# Altium schematic sheet MCU.SchDoc
size A3; DrawnBy: JimBobJones; DocumentNumber: 3; SheetNumber: 3; SheetTotal: 4
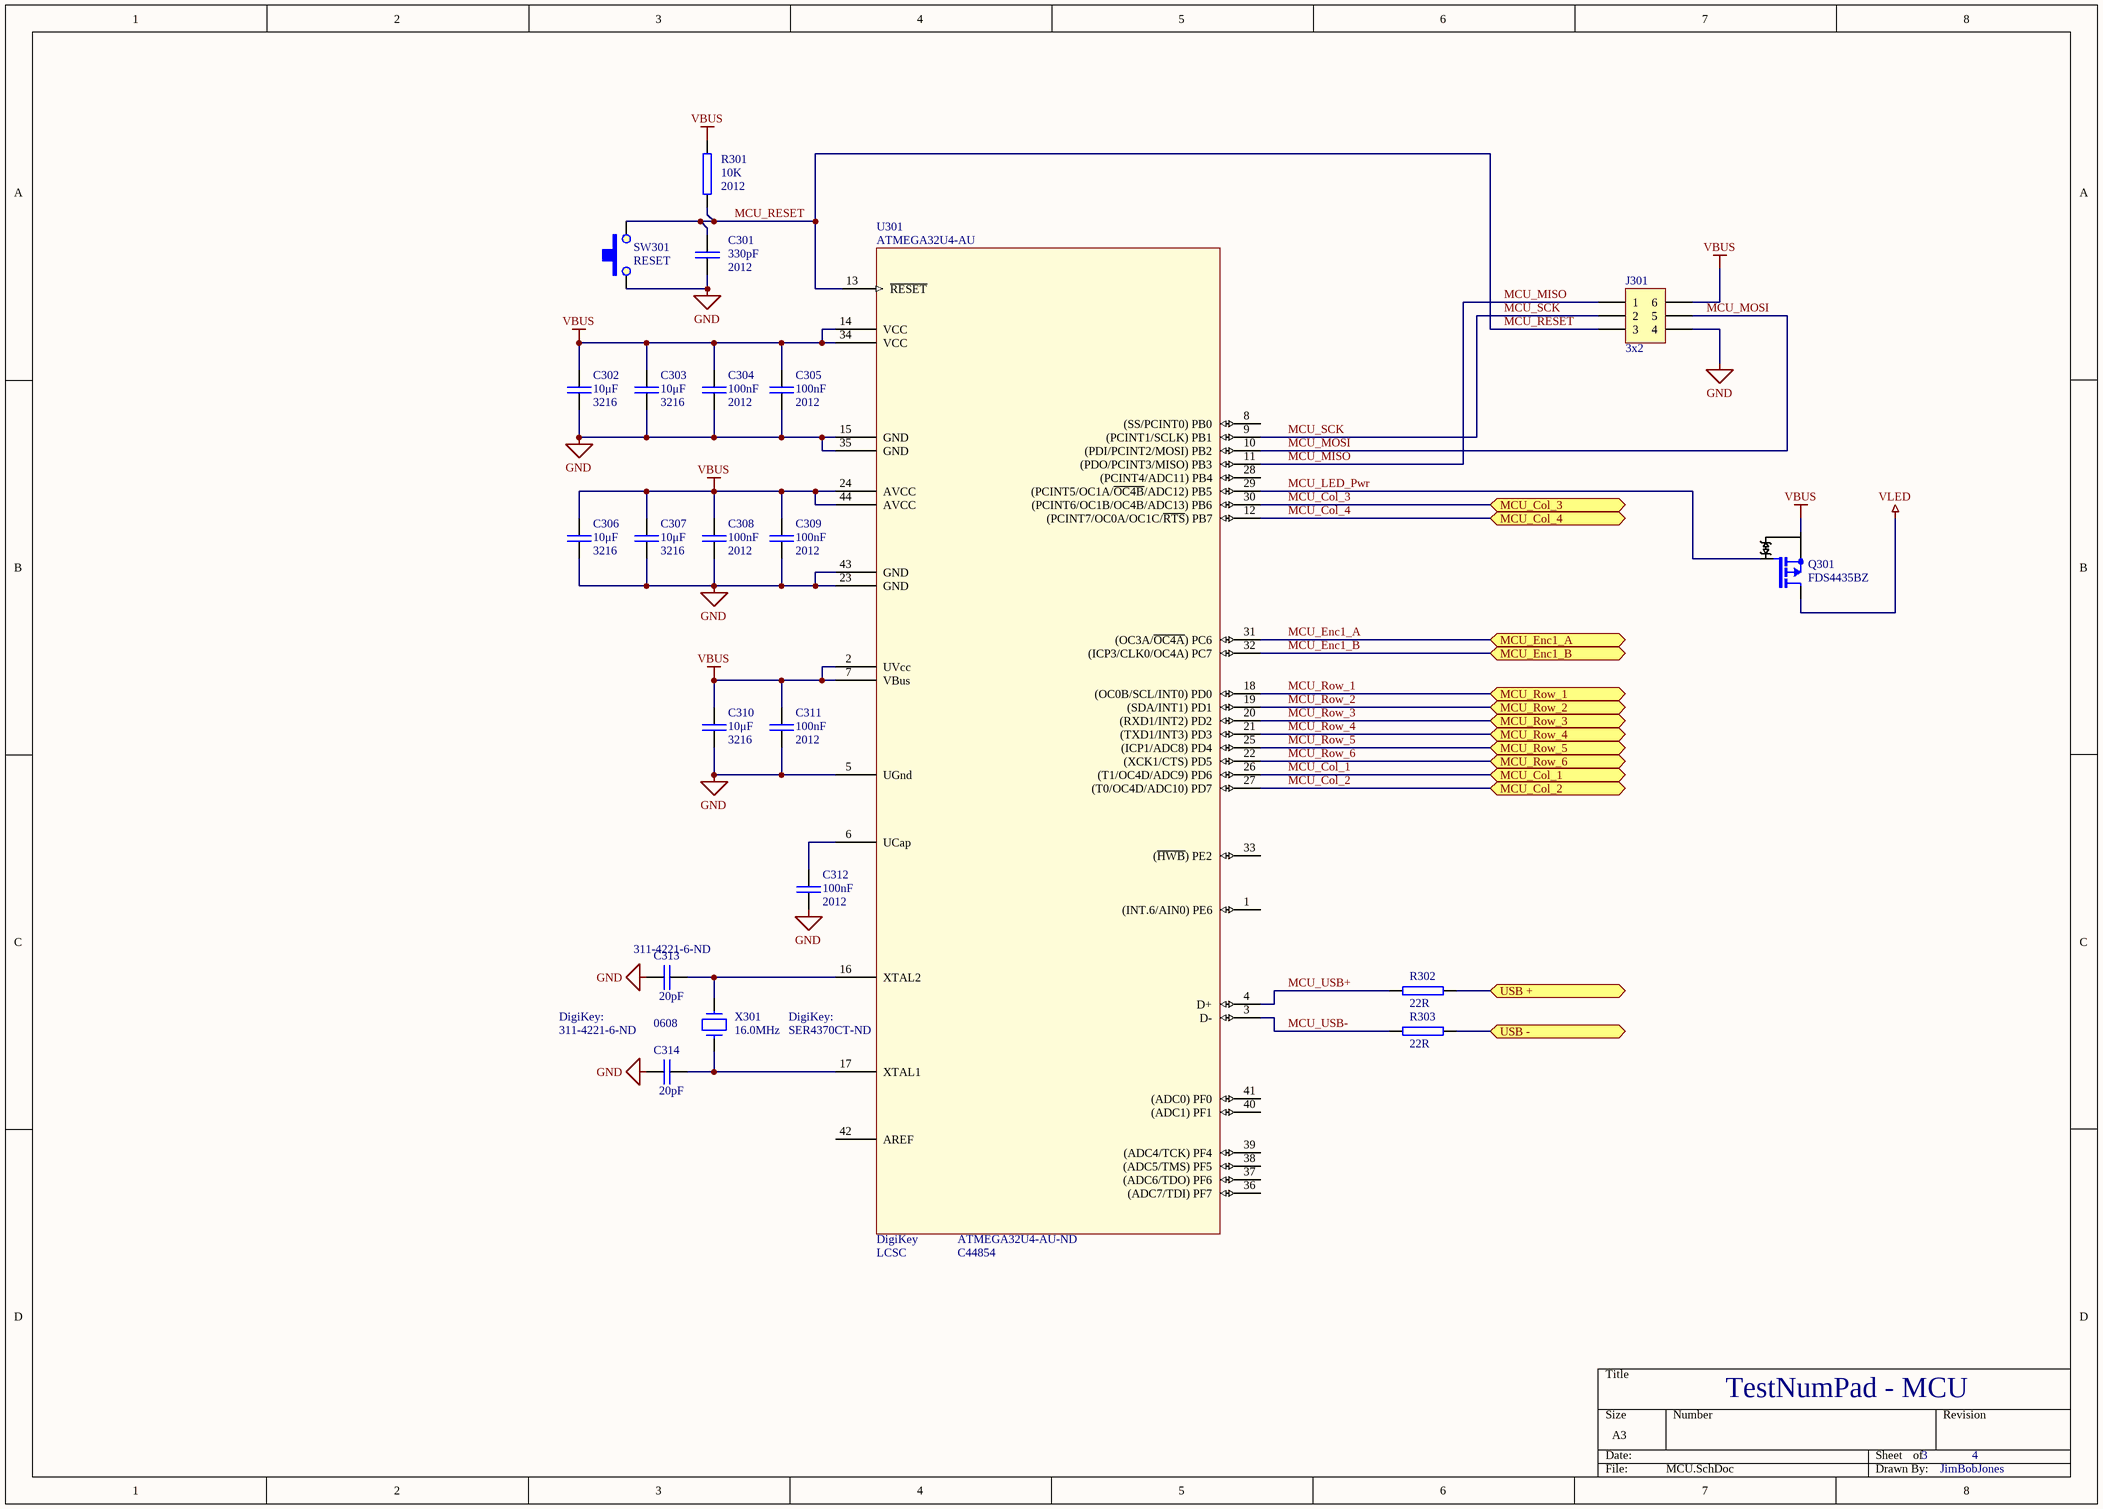
[diagram p0: MCU.SchDoc]

## Parts
C301  330pF  [2012C (0805)]
C302  10μF  [3216C (1206)]
C303  10μF  [3216C (1206)]
C304  100nF  [2012C (0805)]
C305  100nF  [2012C (0805)]
C306  10μF  [3216C (1206)]
C307  10μF  [3216C (1206)]
C308  100nF  [2012C (0805)]
C309  100nF  [2012C (0805)]
C310  10μF  [3216C (1206)]
C311  100nF  [2012C (0805)]
C312  100nF  [2012C (0805)]
C313  20pF  Supplier Part Number 1: 311-4221-6-ND  [1608C (0603)]
C314  20pF  Supplier Part Number 1: 311-4221-6-ND  [1608C (0603)]
J301  3x2  [Header-3x2-NoMod]
Q301  FDS4435BZ  [SO8-150/200mil-GDS]
R301  10K  [2012R-10K]
R302  22R  [2012R-22]
R303  22R  [2012R-22]
SW301  RESET  [SW_PB6x6]
U301  ATMEGA32U4-AU  Supplier Part Number 1: C44854  Supplier Part Number 2: ATMEGA32U4-AU-ND  [TQFP-44-0.8]
X301  16.0MHz  Supplier Part Number 1: SER4370CT-ND  [Crystal_4-SMD]

## Ports
MCU_Col_1 (bidir), MCU_Col_2 (bidir), MCU_Col_3 (bidir), MCU_Col_4 (bidir), MCU_Enc1_A (bidir), MCU_Enc1_B (bidir), MCU_Row_1 (bidir), MCU_Row_2 (bidir), MCU_Row_3 (bidir), MCU_Row_4 (bidir), MCU_Row_5 (bidir), MCU_Row_6 (bidir), USB + (bidir), USB - (bidir)

## Nets
GND: C301.2 C302.2 C303.2 C304.2 C305.2 C306.2 C307.2 C308.2 C309.2 C310.2 C311.2 C312.2 C313.1 C314.1 J301.4 SW301.1(COM) U301.5(UGnd) U301.15(GND) U301.23(GND) U301.35(GND) U301.43(GND)
VBUS: C302.1 C303.1 C304.1 C305.1 C306.1 C307.1 C308.1 C309.1 C310.1 C311.1 J301.6 Q301.S R301.1 U301.2(UVcc) U301.7(VBus) U301.14(VCC) U301.24(AVCC) U301.34(VCC) U301.44(AVCC)
VLED: Q301.D
MCU_Col_1: U301.26((T1/OC4D/ADC9)_PD6) ; port MCU_Col_1
MCU_Col_2: U301.27((T0/OC4D/ADC10)_PD7) ; port MCU_Col_2
MCU_Col_3: U301.30((PCINT6/OC1B/OC4B/ADC13)_PB6) ; port MCU_Col_3
MCU_Col_4: U301.12((PCINT7/OC0A/OC1C/~{RTS})_PB7) ; port MCU_Col_4
MCU_Enc1_A: U301.31((OC3A/~{OC4A})_PC6) ; port MCU_Enc1_A
MCU_Enc1_B: U301.32((ICP3/CLK0/OC4A)_PC7) ; port MCU_Enc1_B
MCU_LED_Pwr: Q301.G U301.29((PCINT5/OC1A/~{OC4B}/ADC12)_PB5)
MCU_MISO: J301.1 U301.11((PDO/PCINT3/MISO)_PB3)
MCU_MOSI: J301.5 U301.10((PDI/PCINT2/MOSI)_PB2)
MCU_RESET: C301.1 J301.3 R301.2 SW301.3(COM) U301.13(~{RESET})
MCU_Row_1: U301.18((OC0B/SCL/INT0)_PD0) ; port MCU_Row_1
MCU_Row_2: U301.19((SDA/INT1)_PD1) ; port MCU_Row_2
MCU_Row_3: U301.20((RXD1/INT2)_PD2) ; port MCU_Row_3
MCU_Row_4: U301.21((TXD1/INT3)_PD3) ; port MCU_Row_4
MCU_Row_5: U301.25((ICP1/ADC8)_PD4) ; port MCU_Row_5
MCU_Row_6: U301.22((XCK1/CTS)_PD5) ; port MCU_Row_6
MCU_SCK: J301.2 U301.9((PCINT1/SCLK)_PB1)
MCU_USB+: R302.1 U301.4(D+)
MCU_USB-: R303.1 U301.3(D-)
USB +: R302.2 ; port USB +
USB -: R303.2 ; port USB -
NetC312_1: C312.1 U301.6(UCap)
NetC313_2: C313.2 U301.16(XTAL2) X301.3
NetC314_2: C314.2 U301.17(XTAL1) X301.1

Not connected (* = marked no-connect by the designer): U301 1((INT.6/AIN0)_PE6) 8((SS/PCINT0)_PB0) 28((PCINT4/ADC11)_PB4) 33((~{HWB})_PE2) 36((ADC7/TDI)_PF7) 37((ADC6/TDO)_PF6) 38((ADC5/TMS)_PF5) 39((ADC4/TCK)_PF4) 40((ADC1)_PF1) 41((ADC0)_PF0) 42(AREF)

## Notes on the sheet
- (near R301) 2012
- (near C301) 2012
- (near C302) 3216
- (near C303) 3216
- (near C304) 2012
- (near C305) 2012
- (near C306) 3216
- (near C307) 3216
- (near C308) 2012
- (near C309) 2012
- (near C310) 3216
- (near C311) 2012
- (near C312) 2012
- DigiKey:
- 0608
- (near U301) DigiKey:
- (near U301) DigiKey
- LCSC
- TestNumPad - MCU

## Library data of the parts
C301 = 2012C-330pF (NPO): Capacitor MLCC 50V C0G (NP0) ±10%
C302 C303 C306 C307 C310 = 3216C-10uF: 3216, 25V MLCC X5R CAPACITOR
C304 C305 C308 C309 C311 C312 = 2012C-100nF: 2012 100nF MLCC Capacitor 50V X7R
C313 C314 = 1608C-20pF (NPO): Capacitor MLCC 50V C0G (NP0) ±10%; Supplier 1: Digi-Key
J301 = Header 3x2: 0.1 inch, 3 Pin Receptacle, 2 Row
Q301 = FDS4435BZ: P-channel, 30V, 3.2A, 120-75mOhm Enhancement MOSFET with 3.8Kv ESD Protection
R301 = 2012R-10K: RESISTOR 2012 1/4 WATT THIN FILM; Reel: *
R302 R303 = 2012R-22: RESISTOR 2012 1/4 WATT THIN FILM; Reel: *
SW301 = SWITCH_SPST_PUSH-6mm: 6mm, SPST Tact switch (DPST Only 1 Contact Used)
U301 = ATMEGA32U4-AU: Atmel ATMEGA Series Microcontroller, 16MHz, 32KB, 2.56KB Ram, 1KB EEPROM, 44 Pin, 26 IO, 2.7V-5.5V, TQFP-44; Supplier 1: LCSC; Supplier 2: Digi-Key
X301 = Crystal-16M: 16MHz Crystal, 16pF, 60R ESR; Supplier 1: Digi-Key